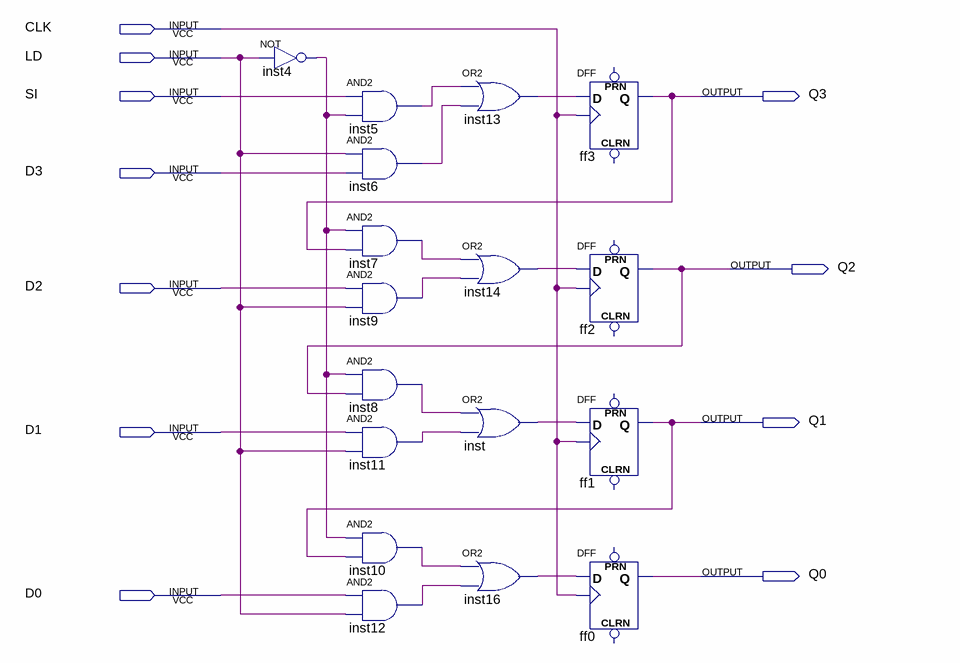
[diagram p0: schematic sheet]
// Quartus schematic ty.bdf as structural Verilog: 17 symbols, 11 pins
module ty (
  input  CLK,
  input  LD,
  input  SI,
  input  D3,
  input  D2,
  input  D1,
  input  D0,
  output Q3,
  output Q2,
  output Q1,
  output Q0
);

  wire inst4_out, inst5_out, inst6_out, inst7_out, inst8_out, inst9_out, inst10_out, inst11_out, inst12_out,
       inst13_out, inst14_out, inst16_out, inst_out;

  not inst4 (inst4_out, LD);
  and inst5 (inst5_out, SI, inst4_out);
  and inst6 (inst6_out, LD, D3);
  and inst7 (inst7_out, inst4_out, Q3);
  and inst9 (inst9_out, D2, LD);
  and inst8 (inst8_out, inst4_out, Q2);
  and inst11 (inst11_out, D1, LD);
  and inst10 (inst10_out, inst4_out, Q1);
  and inst12 (inst12_out, D0, LD);
  or inst13 (inst13_out, inst5_out, inst6_out);
  or inst14 (inst14_out, inst7_out, inst9_out);
  or inst (inst_out, inst8_out, inst11_out);
  or inst16 (inst16_out, inst10_out, inst12_out);
  DFF ff3 (.CLK(CLK), .D(inst13_out), .Q(Q3));  // open: CLRN, PRN
  DFF ff2 (.CLK(CLK), .D(inst14_out), .Q(Q2));  // open: CLRN, PRN
  DFF ff1 (.CLK(CLK), .D(inst_out), .Q(Q1));  // open: CLRN, PRN
  DFF ff0 (.CLK(CLK), .D(inst16_out), .Q(Q0));  // open: CLRN, PRN
endmodule
